# EAGLE design SUBA (EAGLE 8.0.0)
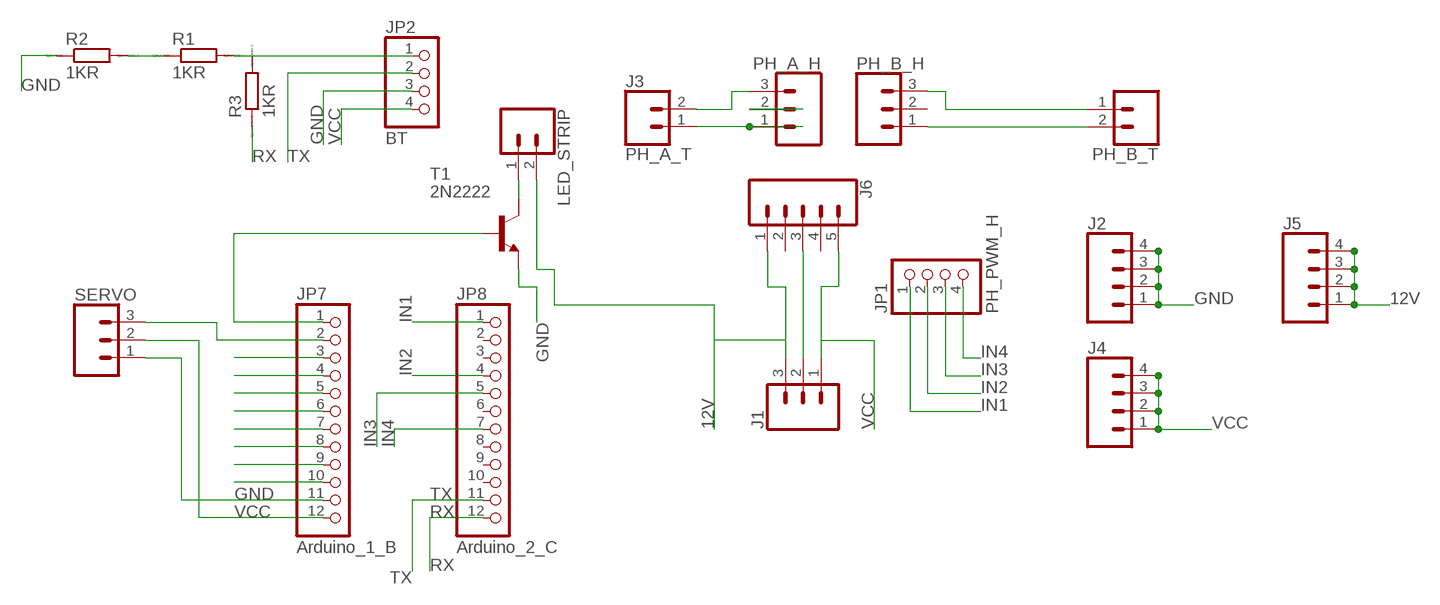
[diagram p0: schematic, sheet 1]

## Parts
J1  CONN_03-SCREW-5MM  [SCREWTERMINAL-5MM-3]
J2  CONN_04  [1X04]
J3  PH_A_T  CONN_025MM  [SCREWTERMINAL-5MM-2]
J4  CONN_04  [1X04]
J5  CONN_04  [1X04]
J6  CONN_05  [1X05]
JP1  PH_PWM_H  PINHD-1X4  [1X04]
JP2  BT  PINHD-1X4  [1X04]
JP7  Arduino_1_B  PINHD-1X12  [1X12]
JP8  Arduino_2_C  PINHD-1X12  [1X12]
LED_STRIP  CONN_02  [1X02]
PH_A_H  CONN_03  [1X03]
PH_B_H  CONN_03  [1X03]
PH_B_T  CONN_025MM  [SCREWTERMINAL-5MM-2]
R1  1KR  R0204/7  [0204/7]
R2  1KR  R0204/7  [0204/7]
R3  1KR  R0204/7  [0204/7]
SERVO  CONN_03  [1X03]
T1  2N2222  [TO92-EBC-OVAL]

## Nets
12V: J1.3 J5.1 J5.2 J5.3 J5.4 J6.1 LED_STRIP.2
GND: J1.2 J2.1 J2.2 J2.3 J2.4 J6.3 JP2.3 JP7.11 R2.1 SERVO.1 T1.E
IN1: JP1.1 JP8.1
IN2: JP1.2 JP8.4
IN3: JP1.3 JP8.5
IN4: JP1.4 JP8.7
N$1: JP7.1 T1.B
N$2: J3.2 PH_A_H.3
N$3: JP7.3
N$4: JP7.4
N$5: JP7.5
N$6: JP7.6
N$7: JP7.7
N$8: PH_A_H.2
N$9: J3.1 PH_A_H.1
N$10: PH_B_H.3 PH_B_T.1
N$11: PH_B_H.1 PH_B_T.2
N$12: R1.1 R2.2
N$13: JP2.1 R1.2 R3.2
N$14: JP7.8
N$16: JP7.10
N$18: JP7.2 SERVO.3
N$21: LED_STRIP.1 T1.C
RX: JP8.12 R3.1
TX: JP2.2 JP8.11
VCC: J1.1 J4.1 J4.2 J4.3 J4.4 J6.5 JP2.4 JP7.9 JP7.12 SERVO.2
Unconnected: J6.2 J6.4 JP8.2 JP8.3 JP8.6 JP8.8 JP8.9 JP8.10 PH_B_H.2

## Library data of the parts
J1 = SparkFun-Connectors:CONN_03: Multi connection point. Often used as Generic Header-pin footprint for 0.1 inch spaced/style header connections On any of the 0.1 inch spaced packages, you can populate with these: Break Away Headers - Straight <https://www.sparkfun.com/products/116> (PRT-00116) Break Away Male Headers - Right Angle <https://www.sparkfun.com/products/553> (PRT-00553) Female Headers <https://www.sparkfun.com/products/115> (PRT-00115) Break Away Headers - Machine Pin <https://www.sparkfun.com/products/117> (PRT-00117) Break Away Female Headers - Swiss Machine Pin <https://www.sparkfun.com/products/743> (PRT-00743) Stackable Header - 3 Pin (Female, 0.1") <https://www.sparkfun.com/products/13875> (PRT-13875) For SCREWTERMINALS and SPRING TERMINALS visit here: Screw Terimnals on SparkFun.com <https://www.sparkfun.com/search/results?term=Screw+Terminals> (5mm/3.5mm/2.54mm spacing) This device is also useful as a general connection point to wire up your design to another part of your project. Our various solder wires solder well into these plated through hole pads. Hook-Up Wire - Assortment (Stranded, 22 AWG) <https://www.sparkfun.com/products/11375> (PRT-11375) Hook-Up Wire - Assortment (Solid Core, 22 AWG) <https://www.sparkfun.com/products/11367> (PRT-11367) View the entire wire category on our website here <https://www.sparkfun.com/categories/141> Special notes: Molex polarized connector foot print use with SKU : PRT-08232 with associated crimp pins and housings.; PROD_ID: CONN-10134; SF_SKU: PRT-08433
J2 J4 J5 = SparkFun-Connectors:CONN_04: Multi connection point. Often used as Generic Header-pin footprint for 0.1 inch spaced/style header connections On any of the 0.1 inch spaced packages, you can populate with these: Break Away Headers - Straight <https://www.sparkfun.com/products/116> (PRT-00116) Break Away Male Headers - Right Angle <https://www.sparkfun.com/products/553> (PRT-00553) Female Headers <https://www.sparkfun.com/products/115> (PRT-00115) Break Away Headers - Machine Pin <https://www.sparkfun.com/products/117> (PRT-00117) Break Away Female Headers - Swiss Machine Pin <https://www.sparkfun.com/products/743> (PRT-00743) For SCREWTERMINALS and SPRING TERMINALS visit here: Screw Terimnals on SparkFun.com <https://www.sparkfun.com/search/results?term=Screw+Terminals> (5mm/3.5mm/2.54mm spacing) This device is also useful as a general connection point to wire up your design to another part of your project. Our various solder wires solder well into these plated through hole pads. Hook-Up Wire - Assortment (Stranded, 22 AWG) <https://www.sparkfun.com/products/11375> (PRT-11375) Hook-Up Wire - Assortment (Solid Core, 22 AWG) <https://www.sparkfun.com/products/11367> (PRT-11367) View the entire wire category on our website here <https://www.sparkfun.com/categories/141> Special notes: Molex polarized connector foot print use with SKU : PRT-08231 with associated crimp pins and housings. 1MM SMD Version SKU: PRT-10208; PROD_ID: CONN-09696
J3 PH_B_T = SparkFun-Connectors:CONN_02: Multi connection point. Often used as Generic Header-pin footprint for 0.1 inch spaced/style header connections On any of the 0.1 inch spaced packages, you can populate with these: Break Away Headers - Straight <https://www.sparkfun.com/products/116> (PRT-00116) Break Away Male Headers - Right Angle <https://www.sparkfun.com/products/553> (PRT-00553) Female Headers <https://www.sparkfun.com/products/115> (PRT-00115) Break Away Headers - Machine Pin <https://www.sparkfun.com/products/117> (PRT-00117) Break Away Female Headers - Swiss Machine Pin <https://www.sparkfun.com/products/743> (PRT-00743) For SCREWTERMINALS and SPRING TERMINALS visit here: Screw Terimnals on SparkFun.com <https://www.sparkfun.com/search/results?term=Screw+Terminals> (5mm/3.5mm/2.54mm spacing) This device is also useful as a general connection point to wire up your design to another part of your project. Our various solder wires solder well into these plated through hole pads. Hook-Up Wire - Assortment (Stranded, 22 AWG) <https://www.sparkfun.com/products/11375> (PRT-11375) Hook-Up Wire - Assortment (Solid Core, 22 AWG) <https://www.sparkfun.com/products/11367> (PRT-11367) View the entire wire category on our website here <https://www.sparkfun.com/categories/141> Special notes: Molex polarized connector foot print use with: PRT-08233 with associated crimp pins and housings. 2.54_SCREWTERM for use with PRT-10571. 3.5mm Screw Terminal footprints for PRT-08084 5mm Screw Terminal footprints for use with PRT-08432; SF_SKU: PRT-08432
J6 = SparkFun-Connectors:CONN_05: Multi connection point. Often used as Generic Header-pin footprint for 0.1 inch spaced/style header connections On any of the 0.1 inch spaced packages, you can populate with these: Break Away Headers - Straight <https://www.sparkfun.com/products/116> (PRT-00116) Break Away Male Headers - Right Angle <https://www.sparkfun.com/products/553> (PRT-00553) Female Headers <https://www.sparkfun.com/products/115> (PRT-00115) Break Away Headers - Machine Pin <https://www.sparkfun.com/products/117> (PRT-00117) Break Away Female Headers - Swiss Machine Pin <https://www.sparkfun.com/products/743> (PRT-00743) For SCREWTERMINALS and SPRING TERMINALS visit here: Screw Terimnals on SparkFun.com <https://www.sparkfun.com/search/results?term=Screw+Terminals> (5mm/3.5mm/2.54mm spacing) This device is also useful as a general connection point to wire up your design to another part of your project. Our various solder wires solder well into these plated through hole pads. Hook-Up Wire - Assortment (Stranded, 22 AWG) <https://www.sparkfun.com/products/11375> (PRT-11375) Hook-Up Wire - Assortment (Solid Core, 22 AWG) <https://www.sparkfun.com/products/11367> (PRT-11367) View the entire wire category on our website here <https://www.sparkfun.com/categories/141> Special notes: Molex polarized connector foot print use with SKU : PRT-08231 with associated crimp pins and housings. 1MM SMD Version SKU: PRT-10208
JP1 JP2 = pinhead:PINHD-1X4: PIN HEADER
JP7 JP8 = pinhead:PINHD-1X12: PIN HEADER
LED_STRIP = SparkFun-Connectors:CONN_02: Multi connection point. Often used as Generic Header-pin footprint for 0.1 inch spaced/style header connections On any of the 0.1 inch spaced packages, you can populate with these: Break Away Headers - Straight <https://www.sparkfun.com/products/116> (PRT-00116) Break Away Male Headers - Right Angle <https://www.sparkfun.com/products/553> (PRT-00553) Female Headers <https://www.sparkfun.com/products/115> (PRT-00115) Break Away Headers - Machine Pin <https://www.sparkfun.com/products/117> (PRT-00117) Break Away Female Headers - Swiss Machine Pin <https://www.sparkfun.com/products/743> (PRT-00743) For SCREWTERMINALS and SPRING TERMINALS visit here: Screw Terimnals on SparkFun.com <https://www.sparkfun.com/search/results?term=Screw+Terminals> (5mm/3.5mm/2.54mm spacing) This device is also useful as a general connection point to wire up your design to another part of your project. Our various solder wires solder well into these plated through hole pads. Hook-Up Wire - Assortment (Stranded, 22 AWG) <https://www.sparkfun.com/products/11375> (PRT-11375) Hook-Up Wire - Assortment (Solid Core, 22 AWG) <https://www.sparkfun.com/products/11367> (PRT-11367) View the entire wire category on our website here <https://www.sparkfun.com/categories/141> Special notes: Molex polarized connector foot print use with: PRT-08233 with associated crimp pins and housings. 2.54_SCREWTERM for use with PRT-10571. 3.5mm Screw Terminal footprints for PRT-08084 5mm Screw Terminal footprints for use with PRT-08432
PH_A_H PH_B_H SERVO = SparkFun-Connectors:CONN_03: Multi connection point. Often used as Generic Header-pin footprint for 0.1 inch spaced/style header connections On any of the 0.1 inch spaced packages, you can populate with these: Break Away Headers - Straight <https://www.sparkfun.com/products/116> (PRT-00116) Break Away Male Headers - Right Angle <https://www.sparkfun.com/products/553> (PRT-00553) Female Headers <https://www.sparkfun.com/products/115> (PRT-00115) Break Away Headers - Machine Pin <https://www.sparkfun.com/products/117> (PRT-00117) Break Away Female Headers - Swiss Machine Pin <https://www.sparkfun.com/products/743> (PRT-00743) Stackable Header - 3 Pin (Female, 0.1") <https://www.sparkfun.com/products/13875> (PRT-13875) For SCREWTERMINALS and SPRING TERMINALS visit here: Screw Terimnals on SparkFun.com <https://www.sparkfun.com/search/results?term=Screw+Terminals> (5mm/3.5mm/2.54mm spacing) This device is also useful as a general connection point to wire up your design to another part of your project. Our various solder wires solder well into these plated through hole pads. Hook-Up Wire - Assortment (Stranded, 22 AWG) <https://www.sparkfun.com/products/11375> (PRT-11375) Hook-Up Wire - Assortment (Solid Core, 22 AWG) <https://www.sparkfun.com/products/11367> (PRT-11367) View the entire wire category on our website here <https://www.sparkfun.com/categories/141> Special notes: Molex polarized connector foot print use with SKU : PRT-08232 with associated crimp pins and housings.
R1-R3 = eagle-ltspice:R: RESISTOR, European symbol; SPICEMODEL: NONE; SPICEPREFIX: R
T1 = adafruit:2N2222: NPN TRANSISTOR Big oval pads

## Board
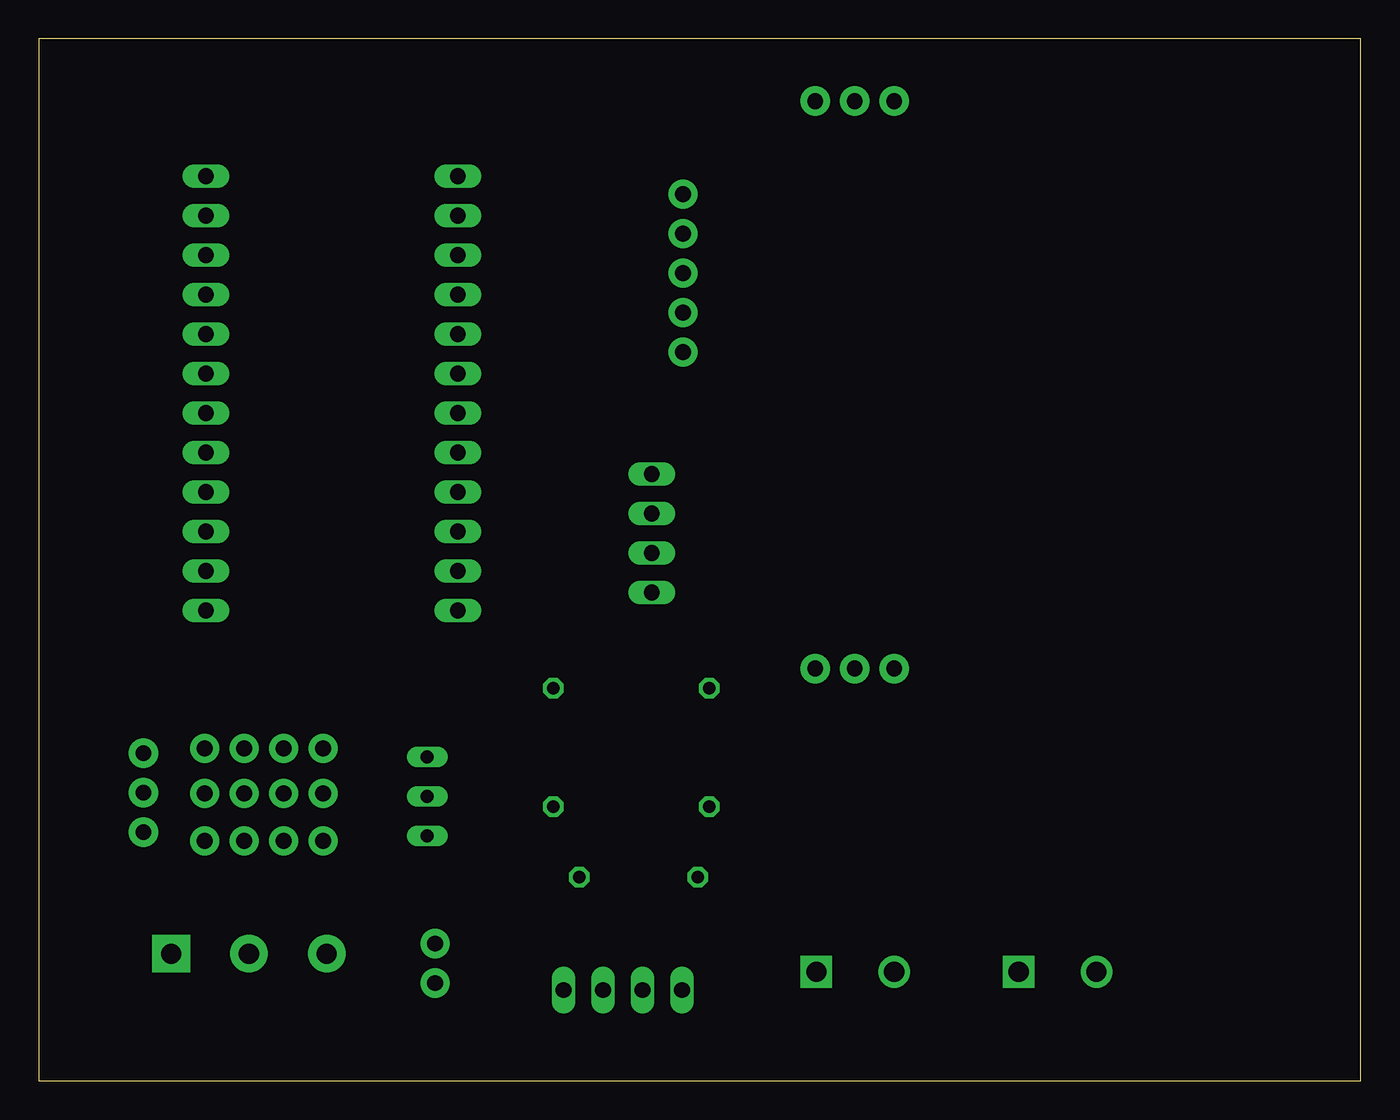
[diagram p1: board, top side]
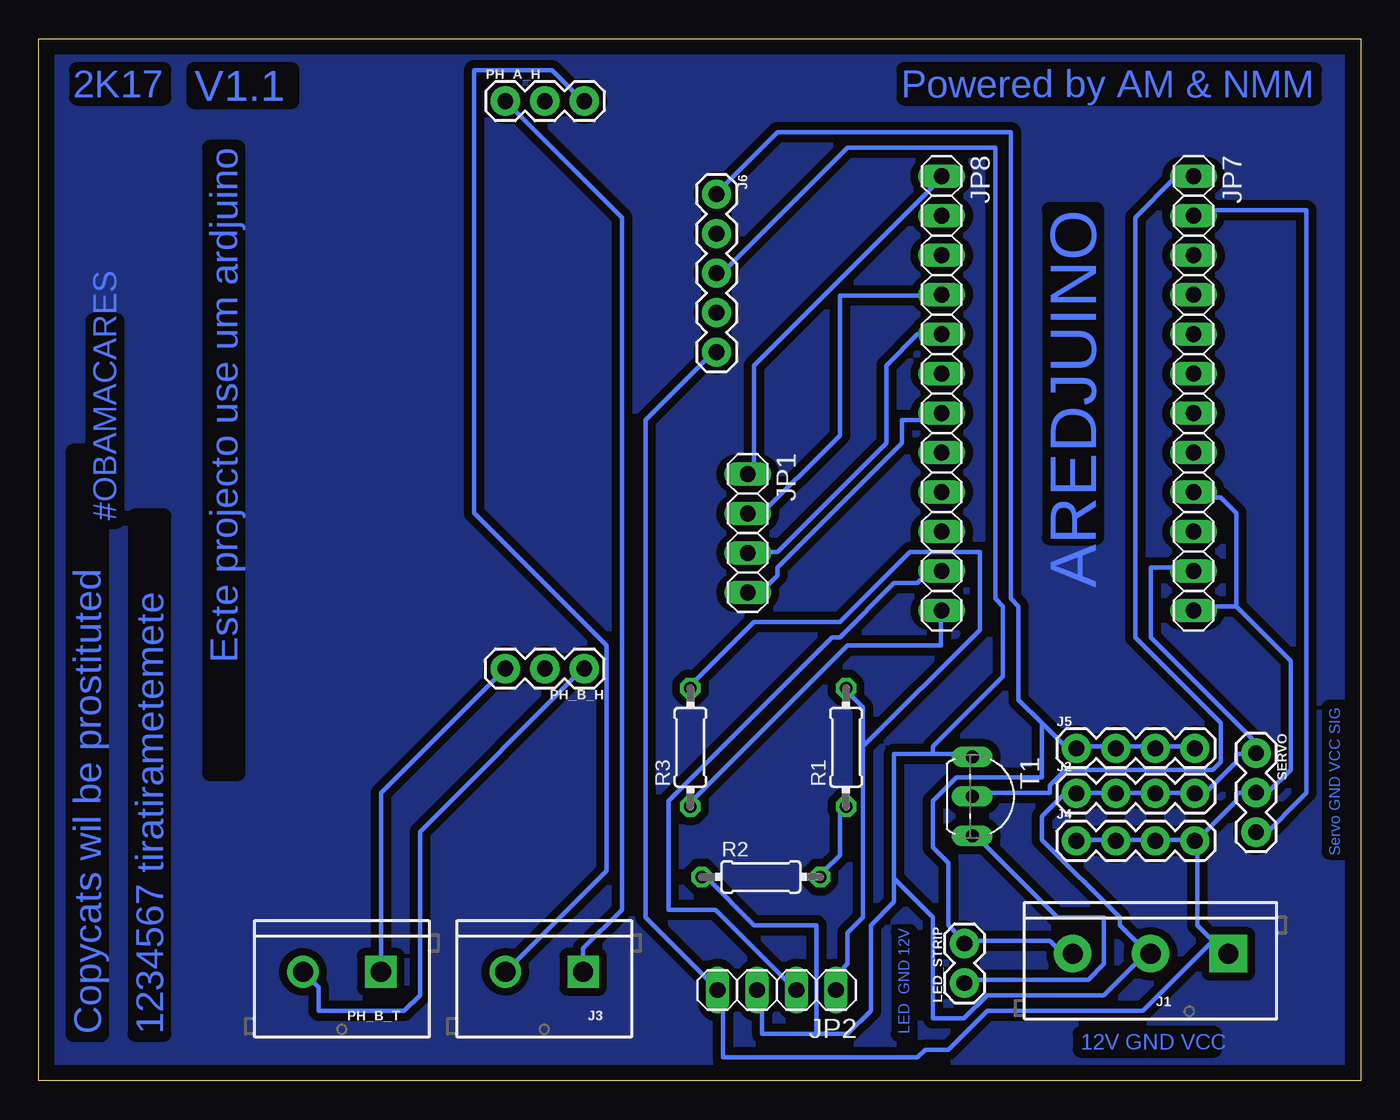
[diagram p2: board, bottom side, seen from below]

Size 85 x 67 mm. Coordinates in mm from the lower left corner, seen from the top.
Outline: 0,0 85,0 85,67 0,67 0,0
Copper layers (1*16): Top 0.035mm / dielectric 1.5mm / Bottom 0.035mm
Design rules "default *": minimum track width 13mil, minimum drill 24mil, track to track 20mil, track to pad 20mil, pad to pad 10mil, via to via 8mil, smd to smd 8mil, copper to edge 40mil, drill to drill 8mil, minimum pad ring 10mil, minimum via ring 8mil, stop-mask expansion 6mil, vias tented up to drill 0mil, thermal gap 10mil

### Footprints (pad centres in the part's own frame; a part is rotated, then mirrored left to right if it is on the bottom)
SCREWTERMINAL-5MM-3 = drill 1.3 pad 2.413 square: 1 0,0 | drill 1.3 pad 2.413: 2 5,0; 3 10,0
1X04 = drill 1.016 pad 1.88: 1 0,0; 2 2.54,0; 3 5.08,0; 4 7.62,0
SCREWTERMINAL-5MM-2 = drill 1.3 pad 2.032 square: 1 0,0 | drill 1.3 pad 2.032: 2 5,0
1X05 = drill 1.016 pad 1.88: 1 0,0; 2 2.54,0; 3 5.08,0; 4 7.62,0; 5 10.16,0
1X04' = drill 1.016 long: 1 -3.81,0; 2 -1.27,0; 3 1.27,0; 4 3.81,0
1X12 = drill 1.016 long: 1 -13.97,0; 2 -11.43,0; 3 -8.89,0; 4 -6.35,0; 5 -3.81,0; 6 -1.27,0; 7 1.27,0; 8 3.81,0; 9 6.35,0; 10 8.89,0; 11 11.43,0; 12 13.97,0
1X02 = drill 1.016 pad 1.88: 1 0,0; 2 2.54,0
1X03 = drill 1.016 pad 1.88: 1 0,0; 2 2.54,0; 3 5.08,0
0204/7 = drill 0.813 octagon: 1 -3.81,0; 2 3.81,0
TO92-EBC-OVAL = drill 0.813 long: B 0,-1.27; C 2.54,-1.27; E -2.54,-1.27

### Placement (x,y rotation side)
J1  8.51,8.16 180 bottom
J2  18.28,18.47 0 bottom
J3  50,7 180 bottom
J4  18.28,15.42 0 bottom
J5  18.28,21.37 0 bottom
J6  41.42,57.01 270 bottom
JP1  PH_PWM_H  [1X04']  39.42,35.21 270 bottom
JP2  BT  [1X04']  37.55,5.83 180 bottom
JP7  10.74,44.2 270 bottom
JP8  26.94,44.2 270 bottom
LED_STRIP  25.48,6.28 90 bottom
PH_A_H  55,63 0 bottom
PH_B_H  49.92,26.5 180 bottom
PH_B_T  63.01,7 180 bottom
R1  33.09,21.44 90 bottom
R2  38.57,13.1 0 bottom
R3  43.1,21.44 90 bottom
SERVO  6.73,21.06 270 bottom
T1  23.7,18.28 270 bottom

### Tracks (layer width: path | path; a pad name or v marks a point on that pad's centre or on a via)
12V
  Bottom 0.305: J1.3 19,8 20,9 25,9 LED_STRIP.2 25.5,9 26.5,10 26.5,14 27.5,15 27.5,18 26,19.5 20.5,19.5 20.5,23 | J5.4 11,21.5 13,21.5 J5.3 13.5,21.5 15.5,21.5 J5.2 16,21.5 18,21.5 J5.1 18.5,21 20.5,23 | 20.5,23 22,24.5 22,30.5 22.5,31 22.5,61 37.5,61 41,57.5 J6.1
GND
  Bottom 0.305: JP7.11 11,33 13.5,33 13.5,28.5 7,22 7,21.5 SERVO.1 7,21 8,21 8,20.5 10.5,18 J2.4 11,18.5 13,18.5 J2.3 13.5,18.5 15.5,18.5 J2.2 16,18.5 18,18.5 J2.1 18.5,18.5 19,18.5 20.5,17 20.5,15.5 15.5,10.5 15.5,10 14,8.5 J1.2 14,8 16.5,5.5 24,5.5 25.5,4 27.5,4 27.5,10.5 30,13 | 27.5,21 30,21 30,13 | 27.5,21 25,21 T1.E | 30,13 30,11.5 31.5,10 31.5,4.5 33,3 35,3 | 35,3 38.5,3 38.5,5.5 JP2.3 | 35,3 35,10 39,10 42,13 R2.1 | 27.5,21 27.5,21.5 23,26 23,30.5 23.5,31 23.5,60 33,60 41,52 J6.3
IN1
  Bottom 0.305: JP8.1 27,58 39,46 39,39.5 JP1.1
IN2
  Bottom 0.305: JP8.4 27,50.5 33.5,50.5 33.5,41.5 39,36 JP1.2
IN3
  Bottom 0.305: JP1.3 39,34 37.5,34 30.5,41 30.5,46 28.5,48 27,48 JP8.5
IN4
  Bottom 0.305: JP8.7 27,42.5 29.5,42.5 29.5,41 37.5,33 37.5,32.5 39,31 JP1.4
N$1
  Bottom 0.305: T1.B 24.5,18.5 20,18.5 20,19 19,20 9.5,20 9,20.5 9,23 14.5,28.5 14.5,55.5 12,58 11,58 JP7.1
N$2
  Bottom 0.305: J3.2 48.5,13.5 48.5,28 57,36.5 57,65 52,65 50,63 PH_A_H.3
N$9
  Bottom 0.305: PH_A_H.1 47.5,55.5 47.5,11 50,8.5 J3.1
N$10
  Bottom 0.305: PH_B_H.3 63,18.5 PH_B_T.1
N$11
  Bottom 0.305: PH_B_H.1 50,26.5 60.5,16 60.5,5.5 61.5,4.5 67,4.5 67,6 PH_B_T.2
N$12
  Bottom 0.305: R2.2 34.5,13.5 33.5,14.5 33.5,17.5 R1.1
N$13
  Bottom 0.305: 32,21.5 32,10.5 33,9.5 33,7.5 33.5,7 33.5,6 JP2.1 | 32,21.5 32,24 33,25 R1.2 | 32,21.5 24.5,29 24.5,34 29,34 33.5,29.5 39,29.5 43,25.5 R3.2
N$15
  pour Bottom: 0,66 0,0 85,0 85,67 0,67
N$18
  Bottom 0.305: JP7.2 10.5,56 3.5,56 3.5,18.5 6.5,15.5 SERVO.3
N$21
  Bottom 0.305: T1.C 24.5,15.5 19.5,10.5 16.5,10.5 16.5,7.5 17.5,6.5 25,6.5 LED_STRIP.1
RX
  Bottom 0.305: R3.1 43,18 33,28 27,28 27,30 JP8.12
TX
  Bottom 0.305: JP2.2 36.5,6 41.5,11 44.5,11 44.5,18 34,28.5 33.5,28.5 30,32 28.5,32 28,32.5 27,32.5 JP8.11
VCC
  Bottom 0.305: 8,30.5 10.5,30.5 JP7.12 | 8,30.5 8,36.5 9,37.5 10.5,37.5 JP7.9 | J4.1 18,15.5 16,15.5 J4.2 15.5,15.5 13.5,15.5 J4.3 13,15.5 11,15.5 J4.4 | J4.4 10.5,15.5 10.5,16 10,16 8,18 8,18.5 7,18.5 SERVO.2 6.5,18.5 6,18.5 4.5,20 4.5,27 8,30.5 | 9.5,9 10.5,10 10.5,15 J4.4 | 9.5,9 9,8.5 J1.1 9.5,9 | J6.5 41.5,47 46,42.5 46,10.5 41.5,6 JP2.4 41,5.5 41,1.5 28.5,1.5 28,2 26.5,2 24,4.5 14,4.5 9.5,9

### Text on the board
Bottom: Powered by AM & NMM | 2K17 | V1.1 | Este projecto use um ardjuino | AREDJUINO | #OBAMACARES | Servo GND VCC SIG | LED GND 12V | 1234567 tiratirametemete | Copycats wil be prostituted | 12V GND VCC